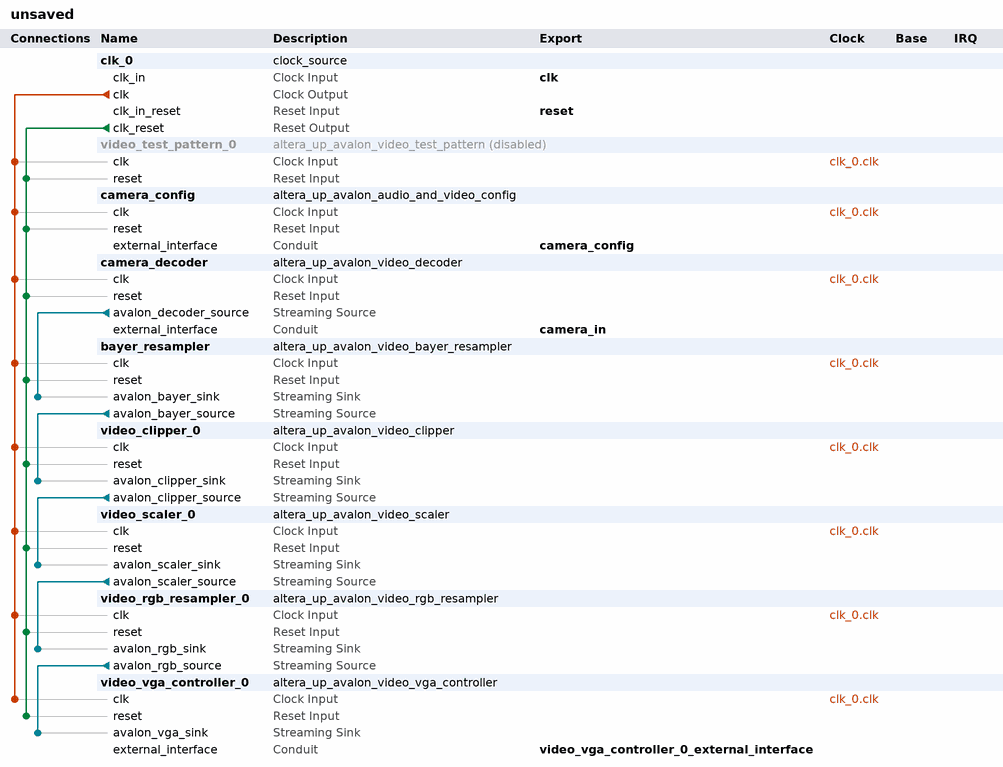
[diagram p0: system contents]
# Platform Designer (Qsys) system unsaved, Cyclone IV GX EP4CGX150DF31C7
# Parameters at their usual value, and those the tool derives, are not listed.
package require -exact qsys 18.0
create_system unsaved
set_project_property DEVICE_FAMILY {Cyclone IV GX}
set_project_property DEVICE EP4CGX150DF31C7

add_instance clk_0 clock_source 18.1
set_instance_parameter_value clk_0 clockFrequency 25000000

add_instance video_test_pattern_0 altera_up_avalon_video_test_pattern 18.0
set_instance_property video_test_pattern_0 ENABLED false
set_instance_parameter_value video_test_pattern_0 height 480
set_instance_parameter_value video_test_pattern_0 width 640

add_instance camera_config altera_up_avalon_audio_and_video_config 18.0
set_instance_parameter_value camera_config audio_in {Microphone to ADC}
set_instance_parameter_value camera_config bit_length 24
set_instance_parameter_value camera_config board DE2i-150
set_instance_parameter_value camera_config dac_enable false
set_instance_parameter_value camera_config line_in_bypass false
set_instance_parameter_value camera_config sampling_rate {48 kHz}

add_instance camera_decoder altera_up_avalon_video_decoder 18.0
set_instance_parameter_value camera_decoder video_source {5MP Digital Camera (THDB_D5M)}

add_instance bayer_resampler altera_up_avalon_video_bayer_resampler 18.0
set_instance_parameter_value bayer_resampler custom_height_in 1944
set_instance_parameter_value bayer_resampler custom_width_in 2592
set_instance_parameter_value bayer_resampler use_custom_format true

add_instance video_clipper_0 altera_up_avalon_video_clipper 18.0
set_instance_parameter_value video_clipper_0 color_bits 8
set_instance_parameter_value video_clipper_0 color_planes 3
set_instance_parameter_value video_clipper_0 drop_bottom 6
set_instance_parameter_value video_clipper_0 drop_left 8
set_instance_parameter_value video_clipper_0 drop_right 8
set_instance_parameter_value video_clipper_0 drop_top 6
set_instance_parameter_value video_clipper_0 height_in 972
set_instance_parameter_value video_clipper_0 width_in 1296

add_instance video_scaler_0 altera_up_avalon_video_scaler 18.0
set_instance_parameter_value video_scaler_0 color_bits 8
set_instance_parameter_value video_scaler_0 color_planes 3
set_instance_parameter_value video_scaler_0 height_in 960
set_instance_parameter_value video_scaler_0 height_scaling 0.5
set_instance_parameter_value video_scaler_0 width_in 1280
set_instance_parameter_value video_scaler_0 width_scaling 0.5

add_instance video_rgb_resampler_0 altera_up_avalon_video_rgb_resampler 18.0
set_instance_parameter_value video_rgb_resampler_0 alpha 1023
set_instance_parameter_value video_rgb_resampler_0 input_type {24-bit RGB}
set_instance_parameter_value video_rgb_resampler_0 output_type {30-bit RGB}

add_instance video_vga_controller_0 altera_up_avalon_video_vga_controller 18.0
set_instance_parameter_value video_vga_controller_0 board DE2i-150
set_instance_parameter_value video_vga_controller_0 resolution {VGA 640x480}

# connections
add_connection clk_0.clk bayer_resampler.clk clock
add_connection clk_0.clk camera_config.clk clock
add_connection clk_0.clk camera_decoder.clk clock
add_connection clk_0.clk video_clipper_0.clk clock
add_connection clk_0.clk video_rgb_resampler_0.clk clock
add_connection clk_0.clk video_scaler_0.clk clock
add_connection clk_0.clk video_test_pattern_0.clk clock
add_connection clk_0.clk video_vga_controller_0.clk clock
add_connection clk_0.clk_reset bayer_resampler.reset reset
add_connection clk_0.clk_reset camera_config.reset reset
add_connection clk_0.clk_reset camera_decoder.reset reset
add_connection clk_0.clk_reset video_clipper_0.reset reset
add_connection clk_0.clk_reset video_rgb_resampler_0.reset reset
add_connection clk_0.clk_reset video_scaler_0.reset reset
add_connection clk_0.clk_reset video_test_pattern_0.reset reset
add_connection clk_0.clk_reset video_vga_controller_0.reset reset
add_connection bayer_resampler.avalon_bayer_source video_clipper_0.avalon_clipper_sink avalon_streaming
add_connection camera_decoder.avalon_decoder_source bayer_resampler.avalon_bayer_sink avalon_streaming
add_connection video_clipper_0.avalon_clipper_source video_scaler_0.avalon_scaler_sink avalon_streaming
add_connection video_rgb_resampler_0.avalon_rgb_source video_vga_controller_0.avalon_vga_sink avalon_streaming
add_connection video_scaler_0.avalon_scaler_source video_rgb_resampler_0.avalon_rgb_sink avalon_streaming

# exported interfaces
add_interface camera_config conduit end
set_interface_property camera_config EXPORT_OF camera_config.external_interface
add_interface camera_in conduit end
set_interface_property camera_in EXPORT_OF camera_decoder.external_interface
add_interface clk clock sink
set_interface_property clk EXPORT_OF clk_0.clk_in
add_interface reset reset sink
set_interface_property reset EXPORT_OF clk_0.clk_in_reset
add_interface video_vga_controller_0_external_interface conduit end
set_interface_property video_vga_controller_0_external_interface EXPORT_OF video_vga_controller_0.external_interface

set_interconnect_requirement {$system} qsys_mm.clockCrossingAdapter HANDSHAKE
set_interconnect_requirement {$system} qsys_mm.enableEccProtection FALSE
set_interconnect_requirement {$system} qsys_mm.insertDefaultSlave FALSE
set_interconnect_requirement {$system} qsys_mm.maxAdditionalLatency 1

save_system unsaved.qsys
